# EAGLE design Shield_Testbed_DCDC (EAGLE 9.6.2)
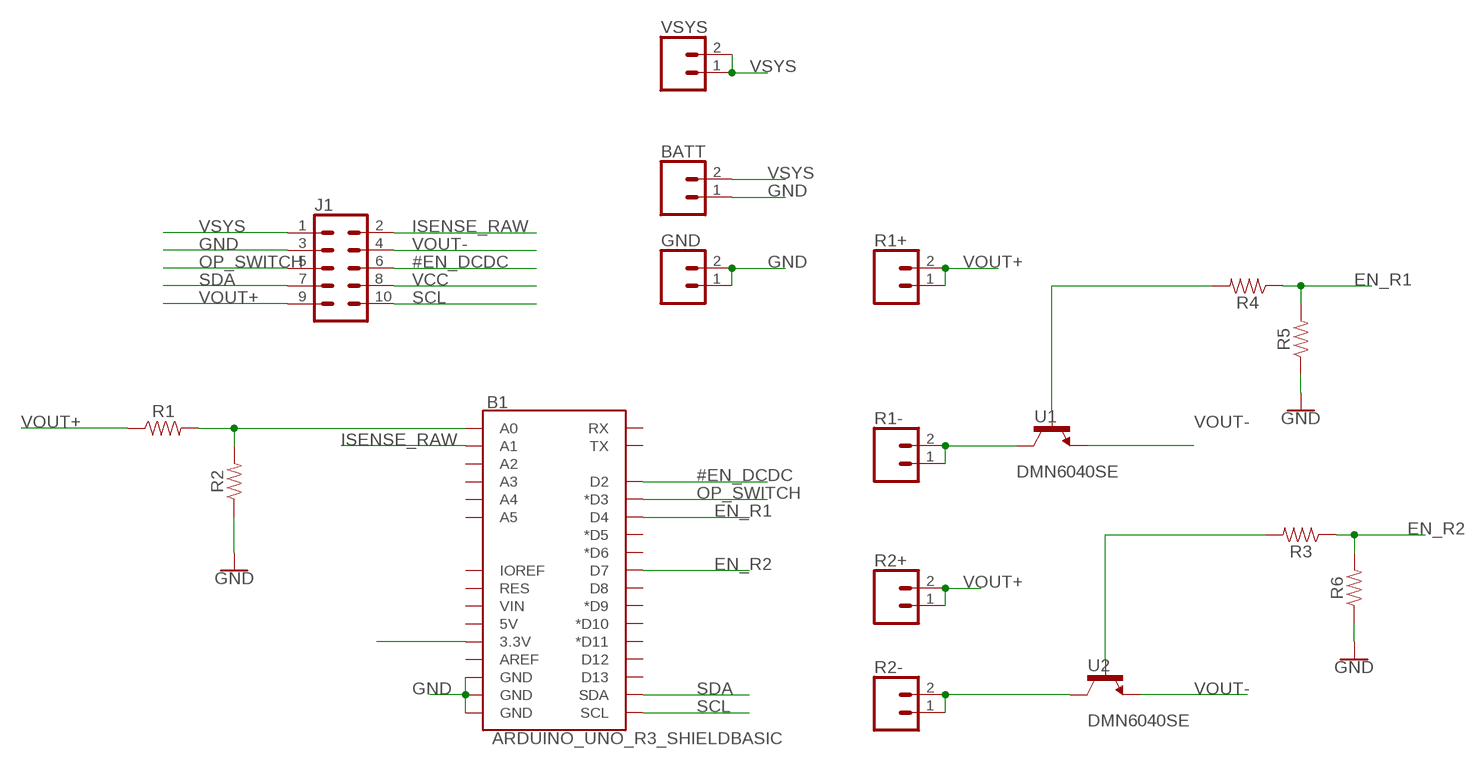
[diagram p0: schematic, sheet 1]

## Parts
B1  ARDUINO_UNO_R3_SHIELDBASIC  [UNO_R3_SHIELD]
BATT  CONN_02  [1X02]
GND  CONN_02  [1X02]
J1  CONN_05X2PTH  [2X5]
R1  RESISTOR0805  [0805]
R1+  CONN_02  [1X02]
R1-  CONN_02  [1X02]
R2  RESISTOR0805  [0805]
R2+  CONN_02  [1X02]
R2-  CONN_02  [1X02]
R3  RESISTOR0805  [0805]
R4  RESISTOR0805  [0805]
R5  RESISTOR0805  [0805]
R6  RESISTOR0805  [0805]
U1  DMN6040SE  [SOT-223_3P7X6P7_ONS]
U2  DMN6040SE  [SOT-223_3P7X6P7_ONS]
VSYS  CONN_02  [1X02]

## Nets
#EN_DCDC: B1.D2 J1.6
EN_R1: B1.D4 R4.1 R5.2
EN_R2: B1.D7 R3.1 R6.2
GND: B1.GND@0(GND) B1.GND@1(GND) B1.GND@2(GND) BATT.1 GND.1 GND.2 J1.3 R2.1 R5.1 R6.1
ISENSE_RAW: B1.A1 J1.2
N$1: B1.A0 R1.2 R2.2
N$2: R3.2 U2.1(G)
N$6: R4.2 U1.1(G)
OP_SWITCH: B1.D3(*D3) J1.5
R1-: R1-.1 R1-.2 U1.2(D) U1.4(D)
R2-: R2-.1 R2-.2 U2.2(D) U2.4(D)
SCL: B1.SCL J1.10
SDA: B1.SDA J1.7
VCC: B1.3.3V J1.8
VOUT+: J1.9 R1+.1 R1+.2 R1.1 R2+.1 R2+.2
VOUT-: J1.4 U1.3(S) U2.3(S)
VSYS: BATT.2 J1.1 VSYS.1 VSYS.2
Unconnected: B1.5V B1.A2 B1.A3 B1.A4 B1.A5 B1.AREF B1.D5(*D5) B1.D6(*D6) B1.D8 B1.D9(*D9) B1.D10(*D10) B1.D11(*D11) B1.D12 B1.D13 B1.IOREF B1.RES B1.RX B1.TX B1.VIN

## Library data of the parts
B1 = SparkFun-Boards:ARDUINO_UNO_R3_SHIELD: Arduino R3 Shield Footprint Shield form compatible with the Arduino Uno R3. SparkFun Products: MG2639 Cellular Shield <https://www.sparkfun.com/products/13120> MIDI Shield <https://www.sparkfun.com/products/12898> R3 Stackable Headers Kit <https://www.sparkfun.com/products/11417>
BATT GND R1+ R1- R2+ R2- VSYS = SparkFun-Connectors:CONN_02: Multi connection point. Often used as Generic Header-pin footprint for 0.1 inch spaced/style header connections On any of the 0.1 inch spaced packages, you can populate with these: Break Away Headers - Straight <https://www.sparkfun.com/products/116> (PRT-00116) Break Away Male Headers - Right Angle <https://www.sparkfun.com/products/553> (PRT-00553) Female Headers <https://www.sparkfun.com/products/115> (PRT-00115) Break Away Headers - Machine Pin <https://www.sparkfun.com/products/117> (PRT-00117) Break Away Female Headers - Swiss Machine Pin <https://www.sparkfun.com/products/743> (PRT-00743) For SCREWTERMINALS and SPRING TERMINALS visit here: Screw Terimnals on SparkFun.com <https://www.sparkfun.com/search/results?term=Screw+Terminals> (5mm/3.5mm/2.54mm spacing) This device is also useful as a general connection point to wire up your design to another part of your project. Our various solder wires solder well into these plated through hole pads. Hook-Up Wire - Assortment (Stranded, 22 AWG) <https://www.sparkfun.com/products/11375> (PRT-11375) Hook-Up Wire - Assortment (Solid Core, 22 AWG) <https://www.sparkfun.com/products/11367> (PRT-11367) View the entire wire category on our website here <https://www.sparkfun.com/categories/141> Special notes: Molex polarized connector foot print use with: PRT-08233 with associated crimp pins and housings. 2.54_SCREWTERM for use with PRT-10571. 3.5mm Screw Terminal footprints for PRT-08084 5mm Screw Terminal footprints for use with PRT-08432
J1 = SparkFun-Connectors:CONN_05X2: Multi connection point. Often used as Generic Header-pin footprint for 0.1 inch spaced/style header connections For AVR SPI programming port, see special device with nice symbol: "AVR_SPI_PROG_5x2.dev" You can populate with any combo of single row headers, but if you'd like an exact match, check these: 2x5 AVR ICSP Male Header <https://www.sparkfun.com/products/778> (PRT-00778) 2x5 Pin Shrouded Header <https://www.sparkfun.com/products/8506> (PRT-08506) On any of the 0.1 inch spaced packages, you can populate with these: Break Away Headers - Straight <https://www.sparkfun.com/products/116> (PRT-00116) Break Away Male Headers - Right Angle <https://www.sparkfun.com/products/553> (PRT-00553) Female Headers <https://www.sparkfun.com/products/115> (PRT-00115) Break Away Headers - Machine Pin <https://www.sparkfun.com/products/117> (PRT-00117) Break Away Female Headers - Swiss Machine Pin <https://www.sparkfun.com/products/743> (PRT-00743) Special note: the shrouded connector mates well with our 5x2 ribbon cables: 2x5 Pin IDC Ribbon Cable <https://www.sparkfun.com/products/8535> (PRT-08535); PROD_ID: CONN-08499; SF_ID: PRT-0778
R1-R6 = SparkFun-Resistors:RESISTOR: Generic Resistor Package
U1 U2 = DMN6040SE:DMN6040SE; COPYRIGHT: Copyright (C) 2021 Ultra Librarian. All rights reserved.; DIGI-KEY_PART_NUMBER_1: SPZT3904T1GOSTR-ND; DIGI-KEY_PART_NUMBER_2: SPZT3904T1GOSCT-ND; DIGI-KEY_PART_NUMBER_3: SPZT3904T1GOSDKR-ND; MANUFACTURER_PART_NUMBER: SPZT3904T1G; MFR_NAME: ON Semiconductor

## Board
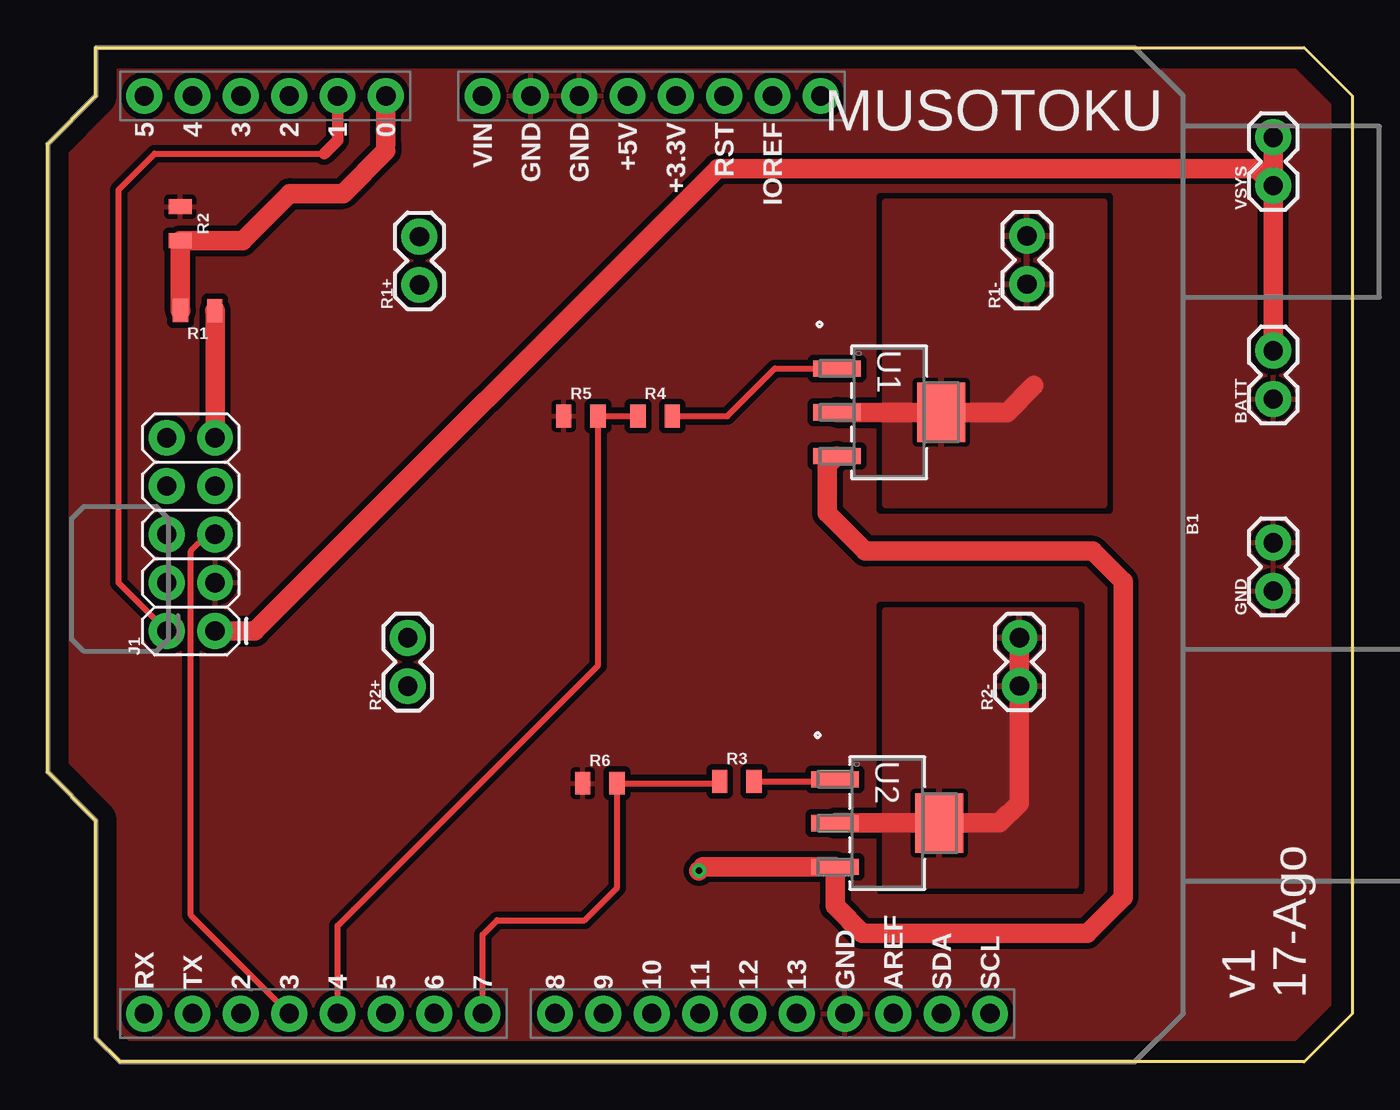
[diagram p1: board, top side]
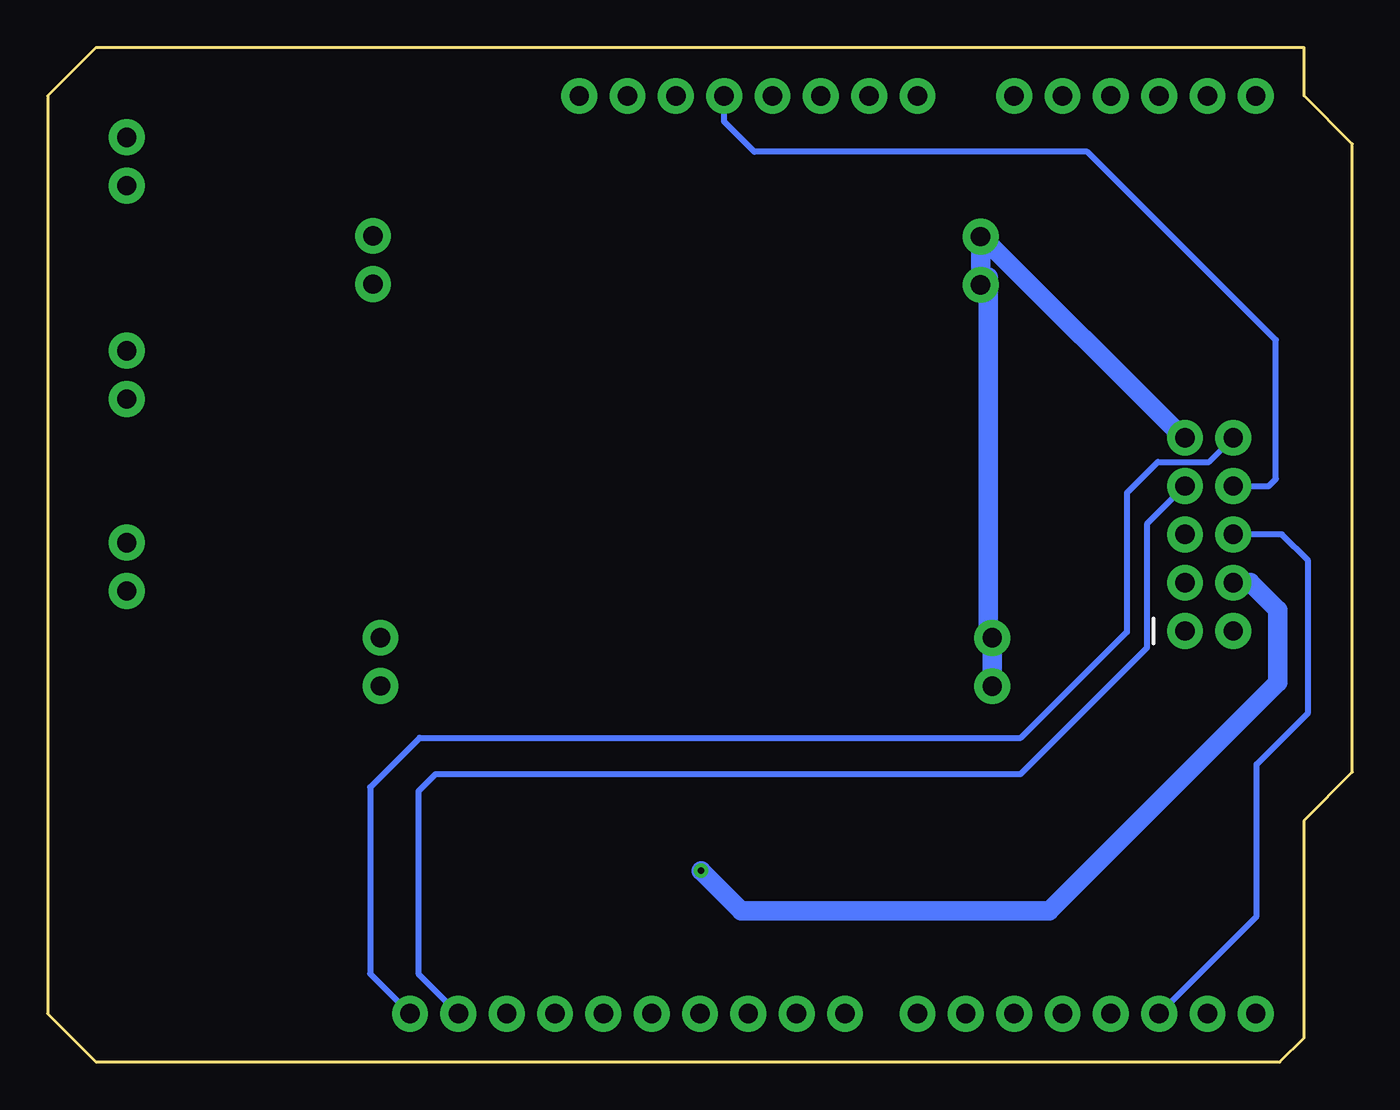
[diagram p2: board, bottom side, seen from below]

Size 68.58 x 53.34 mm. Coordinates in mm from the lower left corner, seen from the top.
Outline: 2.54,1.27 2.54,12.7 0,15.24 0,48.26 2.54,50.8 2.54,53.34 66.04,53.34 68.58,50.8 68.58,2.54 66.04,0 3.81,0 2.54,1.27
Copper layers (1*16): Top 0.035mm / dielectric 1.5mm / Bottom 0.035mm
Design rules "default": minimum track width 6mil, minimum drill 0.35mm, track to track 6mil, track to pad 6mil, pad to pad 6mil, via to via 6mil, smd to smd 6mil, copper to edge 40mil, drill to drill 6mil, minimum pad ring 10mil, minimum via ring 8mil, stop-mask expansion 4mil, vias tented up to drill 0mil, thermal gap 10mil

### Footprints (pad centres in the part's own frame; a part is rotated, then mirrored left to right if it is on the bottom)
UNO_R3_SHIELD = drill 1.016 pad 1.88: 3.3V 24.13,-2.54; 5V 24.13,0; A0 24.13,12.7; A1 24.13,15.24; A2 24.13,17.78; A3 24.13,20.32; A4 24.13,22.86; A5 24.13,25.4; AREF -24.13,-13.97; D2 -24.13,20.32; D3 -24.13,17.78; D4 -24.13,15.24; D5 -24.13,12.7; D6 -24.13,10.16; D7 -24.13,7.62; D8 -24.13,3.81; D9 -24.13,1.27; D10 -24.13,-1.27; D11 -24.13,-3.81; D12 -24.13,-6.35; D13 -24.13,-8.89; GND@0 24.13,2.54; GND@1 24.13,5.08; GND@2 -24.13,-11.43; IOREF 24.13,-7.62; NC 24.13,-10.16; RES 24.13,-5.08; RX -24.13,25.4; SCL -24.13,-19.05; SDA -24.13,-16.51; TX -24.13,22.86; VIN 24.13,7.62
1X02 = drill 1.016 pad 1.88: 1 0,0; 2 2.54,0
2X5 = drill 1.016 pad 1.88: 1 0,0; 2 0,2.54; 3 2.54,0; 4 2.54,2.54; 5 5.08,0; 6 5.08,2.54; 7 7.62,0; 8 7.62,2.54; 9 10.16,0; 10 10.16,2.54
0805 = smd 0.8 x 1.2: 1 -0.9,0; 2 0.9,0
SOT-223_3P7X6P7_ONS = smd 0.864 x 2.515: 1 -2.3,-2.743; 2 0,-2.743; 3 2.3,-2.743 | smd 3.15 x 2.515: 4 0,2.743

### Placement (x,y rotation side)
B1  30.48,26.67 90 top
BATT  64.42,34.86 90 top
GND  64.42,24.77 90 top
J1  8.8,22.66 90 top
R1  7.89,39.51 180 top
R1+  19.54,40.86 90 top
R1-  51.47,40.9 90 top
R2  6.98,44.08 270 top
R2+  18.93,19.76 90 top
R2-  51.08,19.77 90 top
R3  36.23,14.76 0 top
R4  31.93,33.96 0 top
R5  28.03,33.96 0 top
R6  29.03,14.66 0 top
U1  44.23,34.16 270 top
U2  44.13,12.56 270 top
VSYS  64.42,46.08 90 top

### Tracks (layer width: path | path; a pad name or v marks a point on that pad's centre or on a via)
#EN_DCDC
  Bottom 0.305: B1.D2 5.03,7.67 5.03,15.66 2.33,18.36 2.33,26.36 3.71,27.74 J1.6
EN_R1
  Top 0.305: B1.D4 15.24,7.17 16.08,8.01 28.93,20.86 R5.2 R4.1
EN_R2
  Top 0.305: B1.D7 22.86,6.69 23.63,7.46 28.23,7.46 29.93,9.16 R6.2 35.23,14.66 R3.1
GND
  pour Top (isolate 0.305, rank 2): -2.97,54.56 -2.97,-3.84 71.03,-3.84 71.03,54.56
ISENSE_RAW
  Top 0.305: J1.2 3.73,25.19 3.73,45.86 5.63,47.76 14.53,47.76
  Top 0.61: B1.A1 15.24,48.47 14.53,47.76
N$1
  Top 0.61: 17.78,47.91 17.78,48.26
  Top 1.016: R1.2 R2.2 10.25,43.18 12.73,45.66 15.53,45.66 17.78,47.91 | 17.78,48.26 B1.A0
N$2
  Top 0.305: R3.2 41.29,14.76 U2.1
N$6
  Top 0.305: R4.2 35.73,33.96 38.23,36.46 U1.1
OP_SWITCH
  Top 0.305: B1.D3 7.53,7.71 7.53,26.86 8.41,27.74 J1.5
R1-
  Top 1.016: 51.83,35.56 50.43,34.16 U1.4 U1.2
  pour Top: 44.03,45.26 55.53,45.26 55.53,29.26 44.03,29.26
R2-
  Top 1.016: R2-.2 R2-.1 51.08,13.61 50.03,12.56 U2.4 U2.2
  pour Top: 44.03,23.76 54.03,23.76 54.03,9.26 44.03,9.26
SCL
  Bottom 0.305: J1.10 7.53,31.55 10.23,31.55 11.86,29.92 11.86,22.6 17.42,17.04 49.03,17.04 51.63,14.44 51.63,4.64 B1.SCL
SDA
  Bottom 0.305: B1.SDA 49.09,4.64 49.09,14.24 48.19,15.14 17.44,15.14 10.8,21.78 10.8,28.28 J1.7
VCC
  Bottom 0.305: J1.8 4.41,30.28 4.03,30.66 4.03,37.96 13.93,47.86 31.43,47.86 33.02,49.45 B1.3.3V
VOUT+
  Top 1.016: R1.1 J1.9
  Bottom 1.016: R2+.1 R2+.2 19.13,22.5 19.13,41.27 R1+.1 R1+.2 19.48,43.4 8.9,32.82 J1.9
VOUT-  (via drill 0.35)
  Top 1.016: v34.23,10.06 34.43,10.26 U2.3 41.39,8.2 42.83,6.76 54.63,6.76 56.53,8.66 56.53,25.26 54.93,26.86 42.99,26.86 40.99,28.86 40.99,31.36 U1.3
  Bottom 1.016: J1.4 5.37,25.2 3.93,23.76 3.93,19.96 15.93,7.96 32.13,7.96 v34.23,10.06
VSYS
  Top 1.016: J1.1 10.9,22.66 35.22,46.98 63.52,46.98 VSYS.1 | BATT.2 VSYS.1 | VSYS.2 VSYS.1

### Text on the board
tNames: MUSOTOKU | v1 / 17-Ago